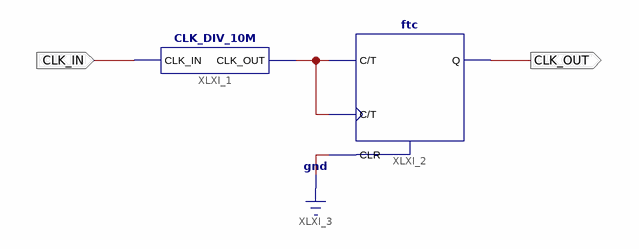
[diagram p0: schematic sheet 1]
// Xilinx ISE schematic CLK_DIV_20M.sch (spartan6) as structural Verilog: 2 symbols, 2 ports
module CLK_DIV_20M (
  input  CLK_IN,
  output CLK_OUT
);

  wire XLXN_2;

  CLK_DIV_10M XLXI_1 (.CLK_IN(CLK_IN), .CLK_OUT(XLXN_2));
  ftc XLXI_2 (.C(XLXN_2), .CLR(1'b0), .T(XLXN_2), .Q(CLK_OUT));
endmodule
